# EAGLE design smallAtmBoard (EAGLE 7.7.0)
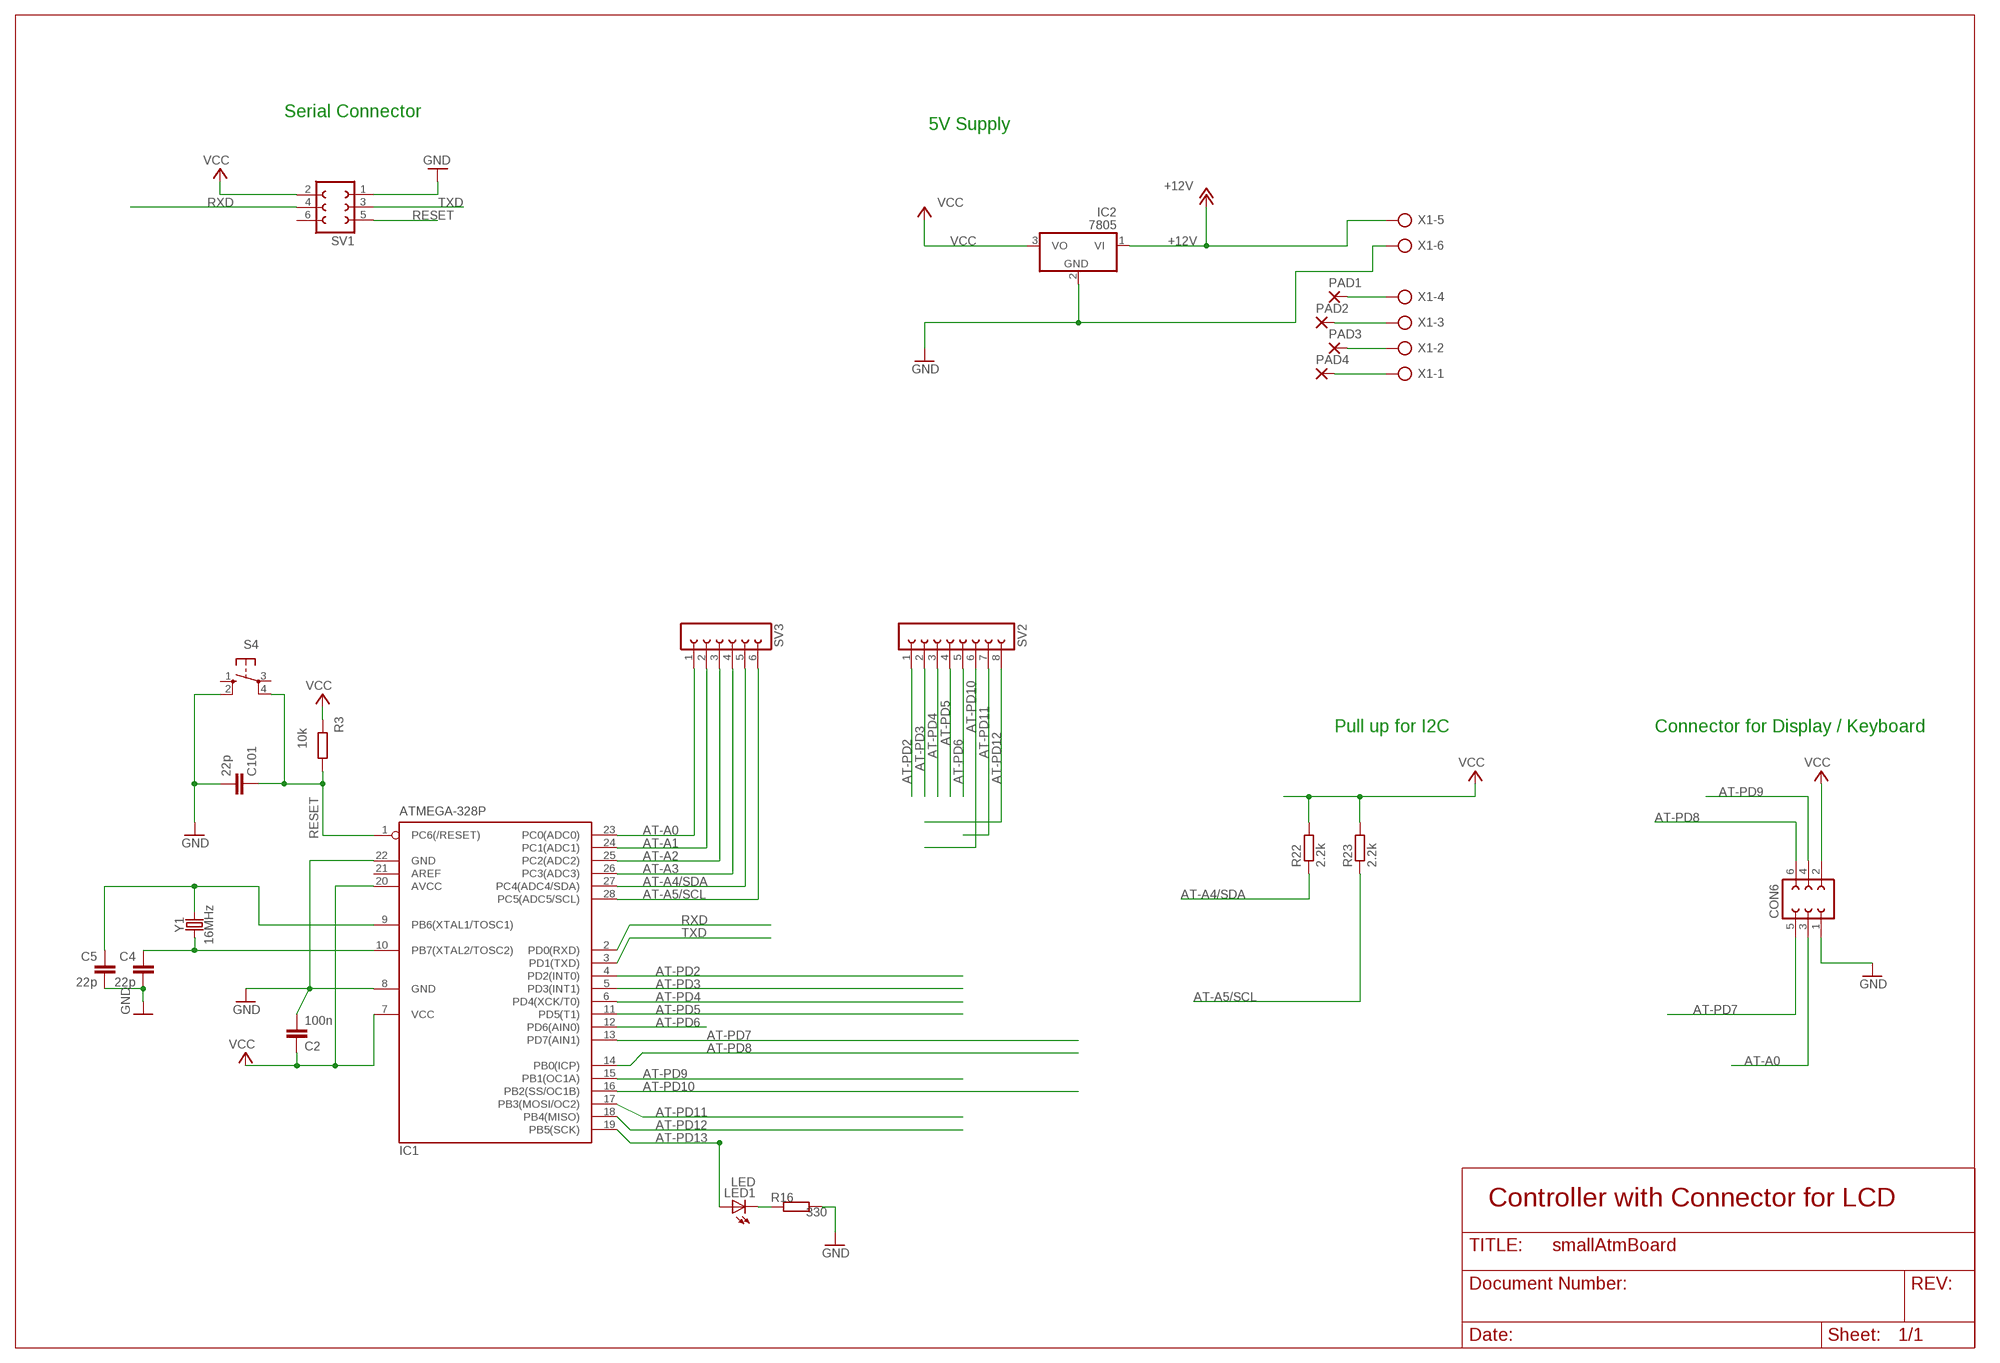
[diagram p0: schematic, sheet 1]

## Parts
C2  100n  C-55MM  [C050-024X044]
C4  22p  C-55MM  [C050-024X044]
C5  22p  C-55MM  [C050-024X044]
C101  22p  C-55MM  [C050-024X044]
CON6  FE03-2  [FE03-2]
IC1  ATMEGA-328P  ATMEGA-XX8-P  [DIL28-3]
IC2  7805  7805-V  [TO220V]
LED1  LED  [LED_LD260]
PAD1  PAD1,6/0,8  [PAD1,6/0,8]
PAD2  PAD1,6/0,8  [PAD1,6/0,8]
PAD3  PAD1,6/0,8  [PAD1,6/0,8]
PAD4  PAD1,6/0,8  [PAD1,6/0,8]
R3  10k  R-EU_0207/2V  [R_0207/2V]
R16  330  R-EU_0207/2V  [R_0207/2V]
R22  2.2k  R-EU_0207/2V  [R_0207/2V]
R23  2.2k  R-EU_0207/2V  [R_0207/2V]
S4  10-XX  [B3F-10XX]
SV1  FE03-2FE03-2RAW  [FE03-2RAW]
SV2  FE08-1FE08-RAW  [FE08-1-RAW]
SV3  FE06-1FE06-1-RAW  [FE06-1-RAW]
X1  AK300/6  [AK300/6]
Y1  16MHz  CRYSTALPTH-HC49US  [HC49US]

## Nets
+12V: IC2.1(VI) X1.5
AT-A0: CON6.3 IC1.23(PC0(ADC0)) SV3.1
AT-A1: IC1.24(PC1(ADC1)) SV3.2
AT-A2: IC1.25(PC2(ADC2)) SV3.3
AT-A3: IC1.26(PC3(ADC3)) SV3.4
AT-A4/SDA: IC1.27(PC4(ADC4/SDA)) R22.1 SV3.5
AT-A5/SCL: IC1.28(PC5(ADC5/SCL)) R23.1 SV3.6
AT-PD2: IC1.4(PD2(INT0)) SV2.1
AT-PD3: IC1.5(PD3(INT1)) SV2.2
AT-PD4: IC1.6(PD4(XCK/T0)) SV2.3
AT-PD5: IC1.11(PD5(T1)) SV2.4
AT-PD6: IC1.12(PD6(AIN0)) SV2.5
AT-PD7: CON6.5 IC1.13(PD7(AIN1))
AT-PD8: CON6.6 IC1.14(PB0(ICP))
AT-PD9: CON6.4 IC1.15(PB1(OC1A))
AT-PD10: IC1.16(PB2(SS/OC1B)) SV2.6
AT-PD11: IC1.17(PB3(MOSI/OC2)) SV2.7
AT-PD12: IC1.18(PB4(MISO)) SV2.8
AT-PD13: IC1.19(PB5(SCK)) LED1.A
GND: C2.2 C4.2 C5.2 C101.2 CON6.1 IC1.8(GND) IC1.22(GND) IC2.2(GND) R16.1 S4.2(S1) SV1.1 X1.6
N$1: LED1.K(C) R16.2
N$115: PAD1.1(P) X1.4
N$119: PAD2.1(P) X1.3
N$123: PAD3.1(P) X1.2
N$175: PAD4.1(P) X1.1
RESET: C101.1 IC1.1(PC6(/RESET)) R3.2 S4.4(P1) SV1.5
RXD: IC1.2(PD0(RXD)) SV1.4
TXD: IC1.3(PD1(TXD)) SV1.3
VCC: C2.1 CON6.2 IC1.7(VCC) IC1.20(AVCC) IC2.3(VO) R3.1 R22.2 R23.2 SV1.2
XTAL1: C5.1 IC1.9(PB6(XTAL1/TOSC1)) Y1.2
XTAL2: C4.1 IC1.10(PB7(XTAL2/TOSC2)) Y1.1
Unconnected: IC1.21(AREF) S4.1(S) S4.3(P) SV1.6

## Notes on the sheet
- Serial Connector
- 5V Supply
- Pull up for I2C | Connector for Display / Keyboard
- Controller with Connector for LCD

## Library data of the parts
C2 C4 C5 C101 = bauteile_jbt:C-5: standard condensator
CON6 SV1 = bauteile_jbt:FE03-2: FEMALE "Wannenbuchse"
IC1 = bauteile_jbt:ATMEGA-XX8-P: MICROCONTROLLER 8 Kbytes FLASH, 1 kbytes SRAM, 512 bytes EEPROM, USART, 4-channel 10 bit ADC, 2-channel 8 bit ADC Pin compatible with Atmega48, ATMega88, ATMega168 Source: avr.lbr; OC_FARNELL: unknown; OC_NEWARK: unknown
IC2 = bauteile_jbt:7805
LED1 = bauteile_jbt:LED
PAD1-PAD4 = bauteile_jbt:PAD1,6/0,8: THROUGH-HOLE PAD
R3 R16 R22 R23 = bauteile_jbt:R-EU_: RESISTOR, European symbol
S4 = bauteile_jbt:10-XX: OMRON SWITCH; MPN: B3F-1000; OC_FARNELL: 176432; OC_NEWARK: 36M3542
SV2 = bauteile_jbt:FE08-1: FEMALE HEADER
SV3 = bauteile_jbt:FE06-1: FEMALE "Wannenbuchse"
X1 = bauteile_jbt:AK300/6: CONNECTOR; OC_FARNELL: unknown; OC_NEWARK: unknown
Y1 = bauteile_jbt:CRYSTAL: 16MHz Crystal Digikey Example <http://www.digikey.com/product-search/en?keywords=535-9122-1-ND> Frequency: 16MHz Frequency Stability: ±50ppm Frequency Tolerance: ±20ppm Load Capacitance: 18pF SparkFun Products: Pro Micro -5V/16MHz <https://www.sparkfun.com/products/12640> SparkFun Serial Enabled LCD Kit <https://www.sparkfun.com/products/10097>

## Net classes
0 default: width 0.15 mm, drill 0.3 mm, clearance 0.205 mm

## Board
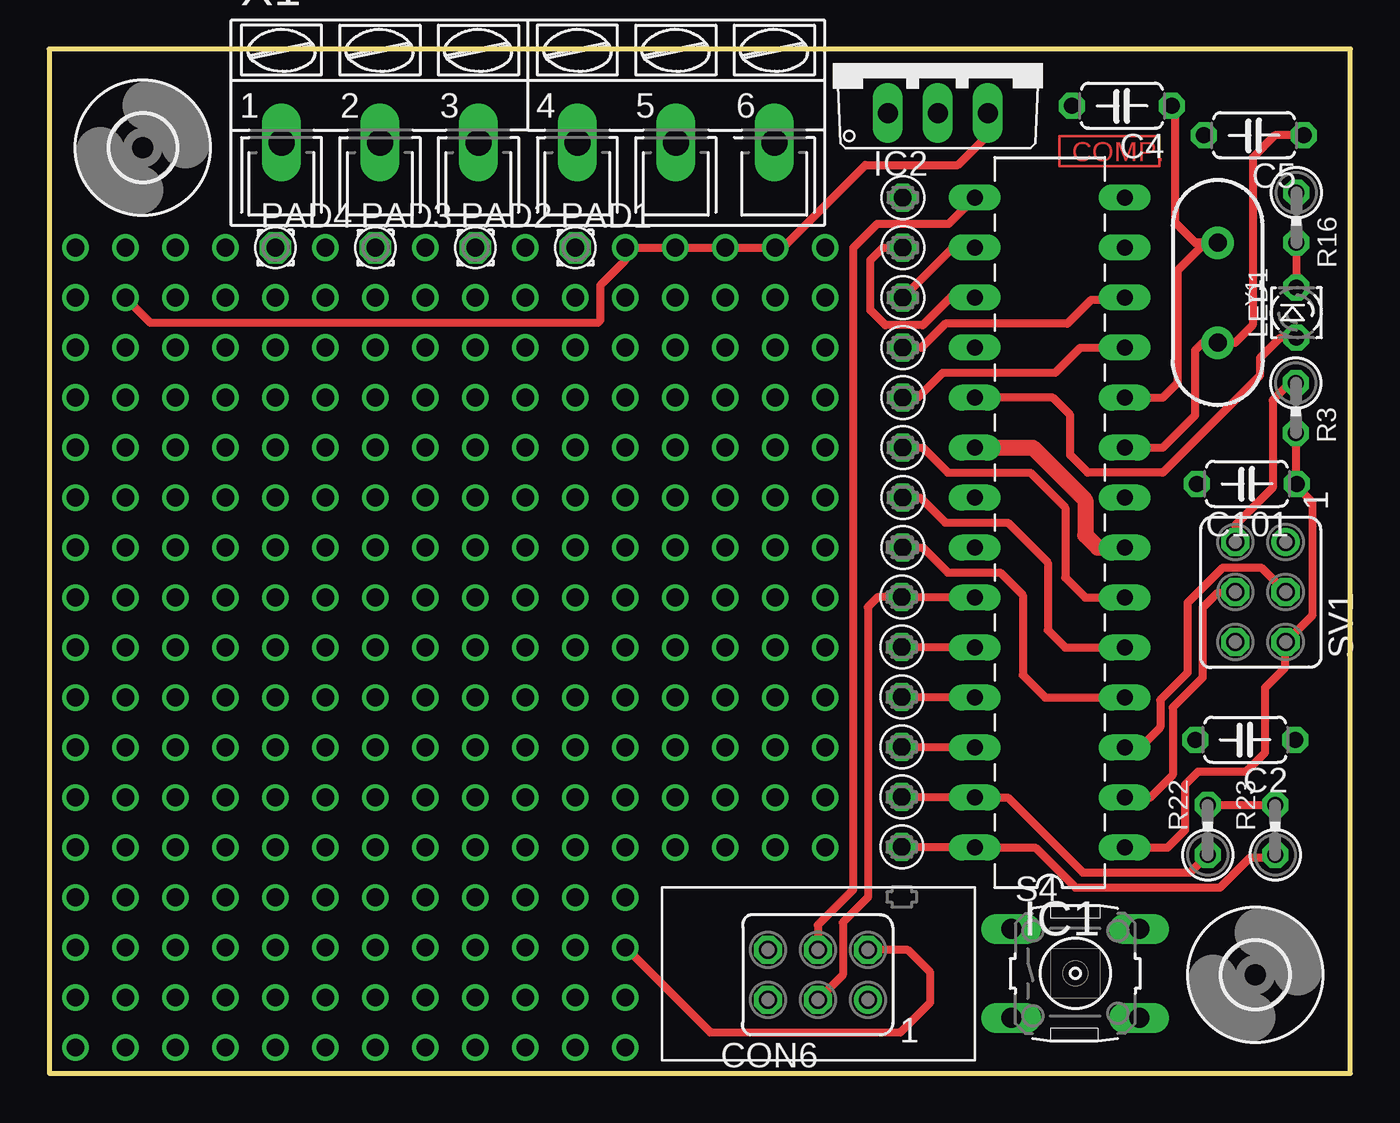
[diagram p1: board, top side]
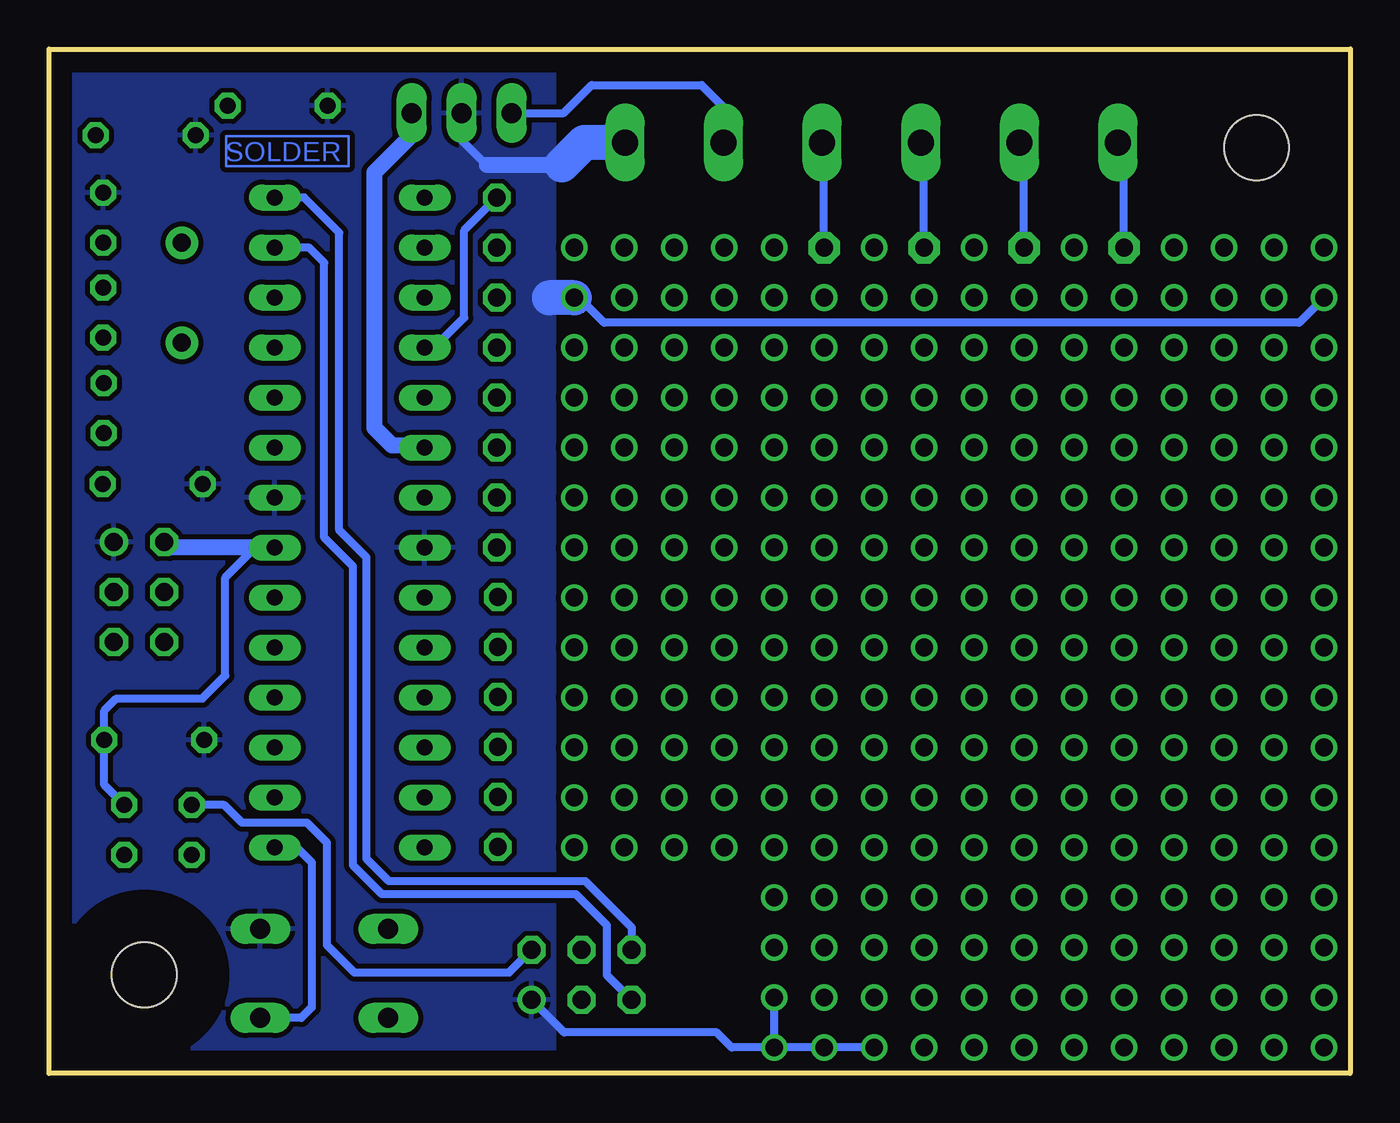
[diagram p2: board, bottom side, seen from below]

Size 66.11 x 52.04 mm. Coordinates in mm from the lower left corner, seen from the top.
Outline: 0.01,0 66.11,0 66.11,52.04 0,52.04 0.01,0
Copper layers (1*16): Top 0.035mm / dielectric 1.5mm / Bottom 0.035mm
Design rules "default *": minimum track width 10mil, minimum drill 24mil, track to track 8mil, track to pad 8mil, pad to pad 8mil, via to via 8mil, smd to smd 8mil, copper to edge 40mil, drill to drill 8mil, minimum pad ring 10mil, minimum via ring 8mil, stop-mask expansion 4mil, vias tented up to drill 0mil, thermal gap 10mil

### Footprints (pad centres in the part's own frame; a part is rotated, then mirrored left to right if it is on the bottom)
C050-024X044 = drill 0.813 octagon: 1 -2.54,0; 2 2.54,0
FE03-2 = drill 0.914: 1 -2.54,1.27 | drill 0.914 octagon: 2 -2.54,-1.27; 3 0,1.27; 4 0,-1.27; 5 2.54,1.27; 6 2.54,-1.27
DIL28-3 = drill 0.813 long: 1 -16.51,-3.81; 2 -13.97,-3.81; 3 -11.43,-3.81; 4 -8.89,-3.81; 5 -6.35,-3.81; 6 -3.81,-3.81; 7 -1.27,-3.81; 8 1.27,-3.81; 9 3.81,-3.81; 10 6.35,-3.81; 11 8.89,-3.81; 12 11.43,-3.81; 13 13.97,-3.81; 14 16.51,-3.81; 15 16.51,3.81; 16 13.97,3.81; 17 11.43,3.81; 18 8.89,3.81; 19 6.35,3.81; 20 3.81,3.81; 21 1.27,3.81; 22 -1.27,3.81; 23 -3.81,3.81; 24 -6.35,3.81; 25 -8.89,3.81; 26 -11.43,3.81; 27 -13.97,3.81; 28 -16.51,3.81
TO220V = drill 1.016 long: 1 -2.54,-2.54; 2 0,-2.54; 3 2.54,-2.54
LED_LD260 = drill 0.813 octagon: A -1.27,0; K 1.27,0
PAD1,6/0,8 = drill 0.9 pad 1.6 octagon: 1 0,0
R_0207/2V = drill 0.813 octagon: 1 -1.27,0; 2 1.27,0
B3F-10XX = drill 1.016 long: 1 -3.251,2.261; 2 3.251,2.261; 3 -3.251,-2.261; 4 3.251,-2.261
FE03-2RAW = drill 0.914: 1 -2.54,1.27 | drill 0.914 octagon: 2 -2.54,-1.27; 3 0,1.27; 4 0,-1.27; 5 2.54,1.27; 6 2.54,-1.27
FE08-1-RAW = drill 0.9 octagon: 1 -8.89,0; 2 -6.35,0; 3 -3.81,0; 4 -1.27,0; 5 1.27,0; 6 3.81,0; 7 6.35,0; 8 8.89,0
FE06-1-RAW = drill 0.9 octagon: 1 -6.35,0; 2 -3.81,0; 3 -1.27,0; 4 1.27,0; 5 3.81,0; 6 6.35,0
3,3 = hole 3.3: 0,0
AK300/6 = drill 1.321 long: 1 -12.522,0; 2 -7.518,0; 3 -2.515,0; 4 2.515,0; 5 7.518,0; 6 12.522,0
HC49US = drill 0.9 pad 1.651: 1 -2.54,0; 2 2.54,0

### Placement (x,y rotation side)
C2  60.77,16.95 180 top
C4  54.5,49.17 180 top
C5  61.22,47.67 180 top
C101  60.85,29.96 180 top
CON6  39.05,5 180 top
IC1  50.84,27.99 90 top
IC2  45.15,51.33 0 top
LED1  63.37,38.66 90 top
PAD1  26.73,41.96 0 top
PAD2  21.65,41.96 0 top
PAD3  16.57,41.96 0 top
PAD4  11.49,41.96 0 top
R3  63.35,33.81 270 top
R16  63.37,43.48 270 top
R22  58.86,12.37 90 top
R23  62.29,12.37 90 top
S4  52.13,5.08 0 top
SV1  61.55,24.46 270 top
SV2  43.37,35.61 90 top
SV3  43.32,17.86 270 top
U$1  [3,3]  61.28,5 0 top
U$3  [3,3]  4.76,47.04 0 top
U$6  [SOLDER]  54.19,46.86 180 top
U$7  [COMP]  53.73,46.86 0 top
X1  24.32,47.29 0 top
Y1  59.37,39.67 270 top

### Tracks (layer width: path | path; a pad name or v marks a point on that pad's centre or on a via)
+12V
  Bottom 0.406: IC2.1 39.97,48.79 38.54,50.22 32.96,50.22 31.94,49.2 31.94,47.4 X1.5
AT-A0
  Top 0.406: IC1.23 47.03,24.21 SV3.1 42.1,24.21 41.59,23.7 41.59,8.94 40.32,7.67 40.32,5 CON6.3
AT-A1
  Top 0.406: SV3.2 47.03,21.67 IC1.24
AT-A2
  Top 0.406: SV3.3 47.03,19.13 IC1.25
AT-A3
  Top 0.406: SV3.4 47.03,16.59 IC1.26
AT-A4/SDA
  Top 0.406: SV3.5 47.03,14.05 IC1.27 48.7,14.02 52.51,10.21 57.98,10.21 R22.1
AT-A5/SCL
  Top 0.406: R23.1 62.17,10.97 61.02,10.97 59.5,9.45 52.13,9.45 50.1,11.48 IC1.28 43.34,11.48 SV3.6
AT-PD2
  Top 0.406: SV2.1 44.39,26.72 45.66,25.45 48.32,25.45 49.47,24.31 49.47,20.24 50.61,19.1 IC1.4
AT-PD3
  Top 0.406: SV2.2 44.26,29.26 45.53,27.99 48.7,27.99 50.74,25.96 50.74,22.53 51.63,21.64 IC1.5
AT-PD4
  Top 0.406: SV2.3 44.39,31.8 45.66,30.53 49.85,30.53 51.63,28.75 51.63,25.2 52.64,24.18 IC1.6
AT-PD5
  Top 0.406: SV2.4 44.13,34.34 45.4,35.61 51.12,35.61 52.39,36.88 IC1.11
AT-PD6
  Top 0.406: IC1.12 54.54,39.32 52.95,39.32 51.73,38.1 45.53,38.1 44.31,36.88 SV2.5
AT-PD7
  Bottom 0.406: IC1.13 52.9,41.96 52.13,41.2 52.13,27.23 50.69,25.78 50.69,10.59 49.21,9.12 39.36,9.12 37.78,7.54 37.78,5 CON6.5
AT-PD8
  Bottom 0.406: IC1.14 53.15,44.5 51.37,42.72 51.37,27.61 50,26.24 50,10.92 48.86,9.78 38.87,9.78 36.51,7.42 CON6.6
AT-PD9
  Top 0.406: IC1.15 45.7,43.18 42.08,43.18 40.86,41.96 40.86,9.35 39.05,7.54 CON6.4
AT-PD10
  Top 0.406: IC1.16 45.91,41.96 SV2.6
AT-PD11
  Top 0.406: IC1.17 45.78,39.42 44.39,38.02 42.48,38.02 41.72,38.79 41.72,41.33 42.35,41.96 SV2.7
AT-PD12
  Bottom 0.406: IC1.18 46.54,36.88 45.02,38.4 45.02,42.85 SV2.8
AT-PD13
  Top 0.406: IC1.19 50.99,34.34 51.88,33.45 51.88,31.42 52.77,30.53 56.58,30.53 61.53,35.48 61.53,36.37 62.55,37.39 LED1.A
GND  (via drill 0.9)
  Bottom 0.406: 43.88,46.15 45.15,47.42 IC2.2 | v24.19,1.32 v26.73,1.32 v29.27,1.32 | v29.27,1.32 31.43,1.32 32.19,2.08 39.94,2.08 CON6.1 | v29.27,3.86 v29.27,1.32 | 40.7,39.42 40.7,39.29 | v1.33,39.42 2.6,38.15 37.91,38.15 39.18,39.42 v39.43,39.42
  Bottom 0.813: 40.07,46.15 43.88,46.15
  Bottom 1.778: X1.6 38.93,47.29 40.07,46.15 | v39.43,39.42 40.7,39.42
  pour Bottom (isolate 0.254): 40.45,50.98 65.24,51 65.24,0.69 40.45,0.79
N$1
  Top 0.406: R16.2 LED1.K
N$2  (via drill 0.9)
  other vias: 8.95,3.86
N$3  (via drill 0.9)
  other vias: 39.43,14.02
N$4  (via drill 0.9)
  other vias: 39.43,16.56
N$5  (via drill 0.9)
  other vias: 39.43,19.1
N$6  (via drill 0.9)
  other vias: 39.43,21.64
N$7  (via drill 0.9)
  other vias: 39.43,24.18
N$8  (via drill 0.9)
  other vias: 39.43,26.72
N$9  (via drill 0.9)
  other vias: 11.49,3.86
N$10  (via drill 0.9)
  other vias: 36.89,14.02
N$11  (via drill 0.9)
  other vias: 36.89,16.56
N$12  (via drill 0.9)
  other vias: 36.89,19.1
N$13  (via drill 0.9)
  other vias: 14.03,6.4
N$14  (via drill 0.9)
  other vias: 34.35,14.02
N$15  (via drill 0.9)
  other vias: 34.35,16.56
N$16  (via drill 0.9)
  other vias: 34.35,19.1
N$17  (via drill 0.9)
  other vias: 14.03,3.86
N$18  (via drill 0.9)
  other vias: 31.81,14.02
N$19  (via drill 0.9)
  other vias: 31.81,16.56
N$20  (via drill 0.9)
  other vias: 31.81,19.1
N$21  (via drill 0.9)
  other vias: 11.49,29.26
N$22  (via drill 0.9)
  other vias: 11.49,24.18
N$23  (via drill 0.9)
  other vias: 11.49,19.1
N$24  (via drill 0.9)
  other vias: 11.49,14.02
N$25  (via drill 0.9)
  other vias: 11.49,8.94
N$26  (via drill 0.9)
  other vias: 11.49,6.4
N$27  (via drill 0.9)
  other vias: 26.73,3.86
N$28  (via drill 0.9)
  other vias: 29.27,14.02
N$29  (via drill 0.9)
  other vias: 29.27,16.56
N$30  (via drill 0.9)
  other vias: 29.27,19.1
N$31  (via drill 0.9)
  other vias: 8.95,6.4
N$32  (via drill 0.9)
  other vias: 26.73,14.02
N$33  (via drill 0.9)
  other vias: 26.73,16.56
N$34  (via drill 0.9)
  other vias: 26.73,19.1
N$35  (via drill 0.9)
  other vias: 8.95,8.94
N$36  (via drill 0.9)
  other vias: 24.19,14.02
N$37  (via drill 0.9)
  other vias: 24.19,16.56
N$38  (via drill 0.9)
  other vias: 24.19,19.1
N$39  (via drill 0.9)
  other vias: 8.95,11.48
N$40  (via drill 0.9)
  other vias: 21.65,14.02
N$41  (via drill 0.9)
  other vias: 21.65,16.56
N$42  (via drill 0.9)
  other vias: 21.65,19.1
N$43  (via drill 0.9)
  other vias: 36.89,21.64
N$44  (via drill 0.9)
  other vias: 36.89,24.18
N$46  (via drill 0.9)
  other vias: 36.89,26.72
N$47  (via drill 0.9)
  other vias: 36.89,29.26
N$48  (via drill 0.9)
  other vias: 34.35,21.64
N$49  (via drill 0.9)
  other vias: 34.35,24.18
N$50  (via drill 0.9)
  other vias: 34.35,26.72
N$51  (via drill 0.9)
  other vias: 34.35,29.26
N$52  (via drill 0.9)
  other vias: 31.81,21.64
N$53  (via drill 0.9)
  other vias: 31.81,24.18
N$54  (via drill 0.9)
  other vias: 31.81,26.72
N$55  (via drill 0.9)
  other vias: 31.81,29.26
N$56  (via drill 0.9)
  other vias: 29.27,21.64
N$57  (via drill 0.9)
  other vias: 29.27,24.18
N$58  (via drill 0.9)
  other vias: 29.27,26.72
N$59  (via drill 0.9)
  other vias: 29.27,29.26
N$60  (via drill 0.9)
  other vias: 36.89,31.8
N$61  (via drill 0.9)
  other vias: 36.89,34.34
N$62  (via drill 0.9)
  other vias: 36.89,36.88
N$63  (via drill 0.9)
  other vias: 36.89,39.42
N$64  (via drill 0.9)
  other vias: 34.35,31.8
N$65  (via drill 0.9)
  other vias: 34.35,34.34
N$66  (via drill 0.9)
  other vias: 34.35,36.88
N$67  (via drill 0.9)
  other vias: 34.35,39.42
N$68  (via drill 0.9)
  other vias: 31.81,31.8
N$69  (via drill 0.9)
  other vias: 31.81,34.34
N$70  (via drill 0.9)
  other vias: 31.81,36.88
N$71  (via drill 0.9)
  other vias: 31.81,39.42
N$72  (via drill 0.9)
  other vias: 29.27,31.8
N$73  (via drill 0.9)
  other vias: 29.27,34.34
N$75  (via drill 0.9)
  other vias: 29.27,36.88
N$76  (via drill 0.9)
  other vias: 29.27,39.42
N$77  (via drill 0.9)
  other vias: 26.73,21.64
N$79  (via drill 0.9)
  other vias: 26.73,24.18
N$80  (via drill 0.9)
  other vias: 26.73,26.72
N$81  (via drill 0.9)
  other vias: 26.73,29.26
N$82  (via drill 0.9)
  other vias: 24.19,21.64
N$83  (via drill 0.9)
  other vias: 24.19,24.18
N$84  (via drill 0.9)
  other vias: 24.19,26.72
N$85  (via drill 0.9)
  other vias: 24.19,29.26
N$86  (via drill 0.9)
  other vias: 21.65,21.64
N$87  (via drill 0.9)
  other vias: 21.65,24.18
N$89  (via drill 0.9)
  other vias: 21.65,26.72
N$90  (via drill 0.9)
  other vias: 21.65,29.26
N$91  (via drill 0.9)
  other vias: 19.11,21.64
N$92  (via drill 0.9)
  other vias: 19.11,24.18
N$93  (via drill 0.9)
  other vias: 19.11,26.72
N$94  (via drill 0.9)
  other vias: 19.11,29.26
N$95  (via drill 0.9)
  other vias: 26.73,31.8
N$96  (via drill 0.9)
  other vias: 26.73,34.34
N$97  (via drill 0.9)
  other vias: 26.73,36.88
N$98  (via drill 0.9)
  other vias: 26.73,39.42
N$99  (via drill 0.9)
  other vias: 24.19,31.8
N$100  (via drill 0.9)
  other vias: 24.19,34.34
N$101  (via drill 0.9)
  other vias: 24.19,36.88
N$102  (via drill 0.9)
  other vias: 24.19,39.42
N$103  (via drill 0.9)
  other vias: 21.65,31.8
N$104  (via drill 0.9)
  other vias: 21.65,34.34
N$105  (via drill 0.9)
  other vias: 21.65,36.88
N$106  (via drill 0.9)
  other vias: 21.65,39.42
N$107  (via drill 0.9)
  other vias: 19.11,31.8
N$108  (via drill 0.9)
  other vias: 19.11,34.34
N$109  (via drill 0.9)
  other vias: 19.11,36.88
N$110  (via drill 0.9)
  other vias: 19.11,39.42
N$111  (via drill 0.9)
  other vias: 19.11,6.4
N$112  (via drill 0.9)
  other vias: 8.95,14.02
N$113  (via drill 0.9)
  other vias: 11.49,26.72
N$114  (via drill 0.9)
  other vias: 11.49,11.48
N$115
  Bottom 0.406: PAD1.1 26.73,47.19 X1.4
N$116  (via drill 0.9)
  other vias: 1.33,1.32
N$117  (via drill 0.9)
  other vias: 11.49,31.8
N$118  (via drill 0.9)
  other vias: 3.87,1.32
N$119
  Bottom 0.406: PAD2.1 21.65,47.14 X1.3
N$120  (via drill 0.9)
  other vias: 6.41,1.32
N$121  (via drill 0.9)
  other vias: 11.49,34.34
N$122  (via drill 0.9)
  other vias: 29.27,11.48
N$123
  Bottom 0.406: PAD3.1 16.57,47.07 X1.2
N$124  (via drill 0.9)
  other vias: 8.95,1.32
N$125  (via drill 0.9)
  other vias: 11.49,36.88
N$126  (via drill 0.9)
  other vias: 31.81,11.48
N$127  (via drill 0.9)
  other vias: 1.33,41.96
N$128  (via drill 0.9)
  other vias: 11.49,1.32
N$129  (via drill 0.9)
  other vias: 11.49,39.42
N$130  (via drill 0.9)
  other vias: 34.35,11.48
N$131  (via drill 0.9)
  other vias: 24.19,41.96
N$132  (via drill 0.9)
  other vias: 21.65,6.4
N$133  (via drill 0.9)
  other vias: 36.89,11.48
N$134  (via drill 0.9)
  other vias: 21.65,3.86
N$135  (via drill 0.9)
  other vias: 3.87,41.96
N$136  (via drill 0.9)
  other vias: 39.43,11.48
N$137  (via drill 0.9)
  other vias: 11.49,21.64
N$138  (via drill 0.9)
  other vias: 16.57,8.94
N$139  (via drill 0.9)
  other vias: 19.11,41.96
N$140  (via drill 0.9)
  other vias: 39.43,29.26
N$141  (via drill 0.9)
  other vias: 39.43,31.8
N$142  (via drill 0.9)
  other vias: 39.43,34.34
N$143  (via drill 0.9)
  other vias: 39.43,36.88
N$145  (via drill 0.9)
  other vias: 39.43,41.96
N$146  (via drill 0.9)
  other vias: 8.95,16.56
N$147  (via drill 0.9)
  other vias: 19.11,3.86
N$149  (via drill 0.9)
  other vias: 16.57,3.86
N$150  (via drill 0.9)
  other vias: 11.49,16.56
N$151  (via drill 0.9)
  other vias: 29.27,8.94
N$152  (via drill 0.9)
  other vias: 16.57,31.8
N$153  (via drill 0.9)
  other vias: 16.57,34.34
N$154  (via drill 0.9)
  other vias: 16.57,36.88
N$155  (via drill 0.9)
  other vias: 16.57,39.42
N$156  (via drill 0.9)
  other vias: 14.03,31.8
N$157  (via drill 0.9)
  other vias: 14.03,34.34
N$158  (via drill 0.9)
  other vias: 14.03,36.88
N$159  (via drill 0.9)
  other vias: 14.03,39.42
N$160  (via drill 0.9)
  other vias: 6.41,41.96
N$161  (via drill 0.9)
  other vias: 14.03,41.96
N$162  (via drill 0.9)
  other vias: 16.57,19.1
N$163  (via drill 0.9)
  other vias: 16.57,21.64
N$164  (via drill 0.9)
  other vias: 16.57,24.18
N$165  (via drill 0.9)
  other vias: 16.57,26.72
N$166  (via drill 0.9)
  other vias: 14.03,19.1
N$167  (via drill 0.9)
  other vias: 14.03,21.64
N$168  (via drill 0.9)
  other vias: 14.03,24.18
N$171  (via drill 0.9)
  other vias: 14.03,26.72
N$172  (via drill 0.9)
  other vias: 16.57,29.26
N$173  (via drill 0.9)
  other vias: 14.03,29.26
N$174  (via drill 0.9)
  other vias: 14.03,1.32
N$175
  Bottom 0.406: PAD4.1 11.49,46.99 X1.1
N$178  (via drill 0.9)
  other vias: 16.57,14.02
N$179  (via drill 0.9)
  other vias: 16.57,1.32
N$180  (via drill 0.9)
  other vias: 14.03,8.94
N$182  (via drill 0.9)
  other vias: 14.03,14.02
N$183  (via drill 0.9)
  other vias: 16.57,16.56
N$184  (via drill 0.9)
  other vias: 14.03,16.56
N$185  (via drill 0.9)
  other vias: 24.19,11.48
N$186  (via drill 0.9)
  other vias: 21.65,11.48
N$187  (via drill 0.9)
  other vias: 19.11,11.48
N$188  (via drill 0.9)
  other vias: 16.57,11.48
N$189  (via drill 0.9)
  other vias: 24.19,8.94
N$191  (via drill 0.9)
  other vias: 19.11,1.32
N$192  (via drill 0.9)
  other vias: 26.73,11.48
N$193  (via drill 0.9)
  other vias: 14.03,11.48
N$194  (via drill 0.9)
  other vias: 21.65,1.32
N$195  (via drill 0.9)
  other vias: 26.73,6.4
N$196  (via drill 0.9)
  other vias: 19.11,14.02
N$197  (via drill 0.9)
  other vias: 19.11,16.56
N$198  (via drill 0.9)
  other vias: 19.11,19.1
N$200  (via drill 0.9)
  other vias: 16.57,6.4
N$202  (via drill 0.9)
  other vias: 21.65,8.94
N$203  (via drill 0.9)
  other vias: 24.19,3.86
N$204  (via drill 0.9)
  other vias: 19.11,8.94
N$206  (via drill 0.9)
  other vias: 24.19,6.4
N$207  (via drill 0.9)
  other vias: 26.73,8.94
N$219  (via drill 0.9)
  other vias: 8.95,19.1
N$220  (via drill 0.9)
  other vias: 8.95,21.64
N$221  (via drill 0.9)
  other vias: 8.95,24.18
N$222  (via drill 0.9)
  other vias: 8.95,26.72
N$223  (via drill 0.9)
  other vias: 8.95,29.26
N$224  (via drill 0.9)
  other vias: 8.95,31.8
N$225  (via drill 0.9)
  other vias: 8.95,34.34
N$226  (via drill 0.9)
  other vias: 8.95,36.88
N$227  (via drill 0.9)
  other vias: 8.95,39.42
N$228  (via drill 0.9)
  other vias: 8.95,41.96
N$229  (via drill 0.9)
  other vias: 6.41,39.42
N$232  (via drill 0.9)
  other vias: 1.33,36.88
N$233  (via drill 0.9)
  other vias: 3.87,36.88
N$234  (via drill 0.9)
  other vias: 6.41,36.88
N$235  (via drill 0.9)
  other vias: 6.41,34.34
N$236  (via drill 0.9)
  other vias: 6.41,31.8
N$238  (via drill 0.9)
  other vias: 6.41,29.26
N$239  (via drill 0.9)
  other vias: 6.41,26.72
N$240  (via drill 0.9)
  other vias: 6.41,24.18
N$241  (via drill 0.9)
  other vias: 6.41,21.64
N$242  (via drill 0.9)
  other vias: 6.41,19.1
N$243  (via drill 0.9)
  other vias: 6.41,16.56
N$244  (via drill 0.9)
  other vias: 6.41,14.02
N$245  (via drill 0.9)
  other vias: 6.41,11.48
N$246  (via drill 0.9)
  other vias: 6.41,8.94
N$247  (via drill 0.9)
  other vias: 6.41,6.4
N$248  (via drill 0.9)
  other vias: 6.41,3.86
N$249  (via drill 0.9)
  other vias: 3.87,3.86
N$250  (via drill 0.9)
  other vias: 3.87,6.4
N$251  (via drill 0.9)
  other vias: 3.87,8.94
N$252  (via drill 0.9)
  other vias: 3.87,11.48
N$253  (via drill 0.9)
  other vias: 3.87,14.02
N$254  (via drill 0.9)
  other vias: 3.87,16.56
N$255  (via drill 0.9)
  other vias: 3.87,19.1
N$256  (via drill 0.9)
  other vias: 3.87,21.64
N$257  (via drill 0.9)
  other vias: 3.87,24.18
N$259  (via drill 0.9)
  other vias: 3.87,26.72
N$260  (via drill 0.9)
  other vias: 3.87,29.26
N$261  (via drill 0.9)
  other vias: 3.87,31.8
N$262  (via drill 0.9)
  other vias: 3.87,34.34
N$263  (via drill 0.9)
  other vias: 1.33,34.34
N$264  (via drill 0.9)
  other vias: 1.33,31.8
N$265  (via drill 0.9)
  other vias: 1.33,29.26
N$266  (via drill 0.9)
  other vias: 1.33,26.72
N$267  (via drill 0.9)
  other vias: 1.33,24.18
N$268  (via drill 0.9)
  other vias: 1.33,21.64
N$269  (via drill 0.9)
  other vias: 1.33,19.1
N$270  (via drill 0.9)
  other vias: 1.33,16.56
N$271  (via drill 0.9)
  other vias: 1.33,14.02
N$272  (via drill 0.9)
  other vias: 1.33,11.48
N$273  (via drill 0.9)
  other vias: 1.33,8.94
N$274  (via drill 0.9)
  other vias: 1.33,6.4
N$275  (via drill 0.9)
  other vias: 1.33,3.86
RESET
  Top 0.406: IC1.1 56.83,11.48 57.72,12.37 57.72,14.68 58.38,15.34 60.82,15.34 61.79,16.31 61.79,19.61 62.8,20.62 62.8,21.9 SV1.5 64.2,23.3 64.2,29 63.39,29.8 C101.1 63.35,30 R3.2
  Bottom 0.406: IC1.1 53.53,11.48 52.77,10.72 52.77,3.35 53.3,2.82 S4.4
RXD
  Top 0.406: IC1.2 55.94,14.02 57.09,15.16 57.09,18.59 58.61,20.12 58.61,23.67 59.37,24.43 60.25,24.43 SV1.4
TXD
  Top 0.406: IC1.3 55.44,16.56 56.45,17.58 56.45,18.97 57.85,20.37 57.85,23.93 59.63,25.7 61.57,25.7 SV1.3
VCC  (via drill 0.9)
  Top 0.406: IC1.7 | SV1.2 60.26,27.02 60.26,27.86 62.17,29.77 62.17,34.21 63.04,35.08 R3.1 | R22.2 R23.2 | IC2.3 47.69,47.68 46.16,46.15 41.47,46.15 37.27,41.96 v36.89,41.96 v34.35,41.96 v31.81,41.96 v29.27,41.96 29.27,41.33 28,40.06 28,38.28 27.88,38.15 5.14,38.15 v3.87,39.42 | v29.27,6.4 33.59,2.08 43.24,2.08 44.77,3.61 44.77,5.13 43.62,6.27 CON6.2
  Top 0.813: IC1.20 49.97,31.8 52.64,29.13 52.64,27.36 53.28,26.72 IC1.7
  Bottom 0.406: 47.15,31.93 IC1.20 | 55.64,26.72 57.16,25.2 57.16,20.22 58.33,19.05 62.7,19.05 63.31,18.44 C2.1 63.31,14.66 R23.2 | R22.2 57.21,13.64 56.32,12.75 53.02,12.75 52.01,11.73 52.01,6.53 50.61,5.13 42.74,5.13 CON6.2
  Bottom 0.813: IC1.7 55.64,26.72 60,26.72 SV1.2 60.39,27.11 | 47.15,31.93 48.7,31.93 49.59,32.82 49.59,45.77 47.69,47.68 IC2.3
XTAL1
  Top 0.406: IC1.9 56.58,31.8 58.23,33.45 58.23,36.75 58.61,37.13 Y1.2 60.26,37.13 61.15,38.02 61.15,46.53 62.28,47.67 C5.1
XTAL2
  Top 0.406: IC1.10 56.58,34.34 57.34,35.1 57.34,40.82 58.74,42.21 Y1.1 58.23,42.21 57.21,43.23 57.21,49 C4.1

### Text on the board
tValues: D12 | + | + | + | - + | 10 | 6 | 5 | 4 | 3 | D2 | A0 | Serial | 1 | 2 | 3 | 4 | A5 | I2C | - | - | LCD/KBD
bValues: Supply | D8 | D12 | D7 | D6 | 10 | 6 | 5 | 4 | 3 | D2 | RX | TX | github.com/benoitjoh 2018 | A0 | R | D1 | SCL | D0 | SDA | A5 | D8 | D9 | + | D7 | A0
DrillLegend: LAYER-STACK
DrillLegend_01-16: 01-16
DrillLegend_01-20: 01-20 | 01-20